# Altium schematic sheet EsquematicoVrBikeV1.SchDoc
size A
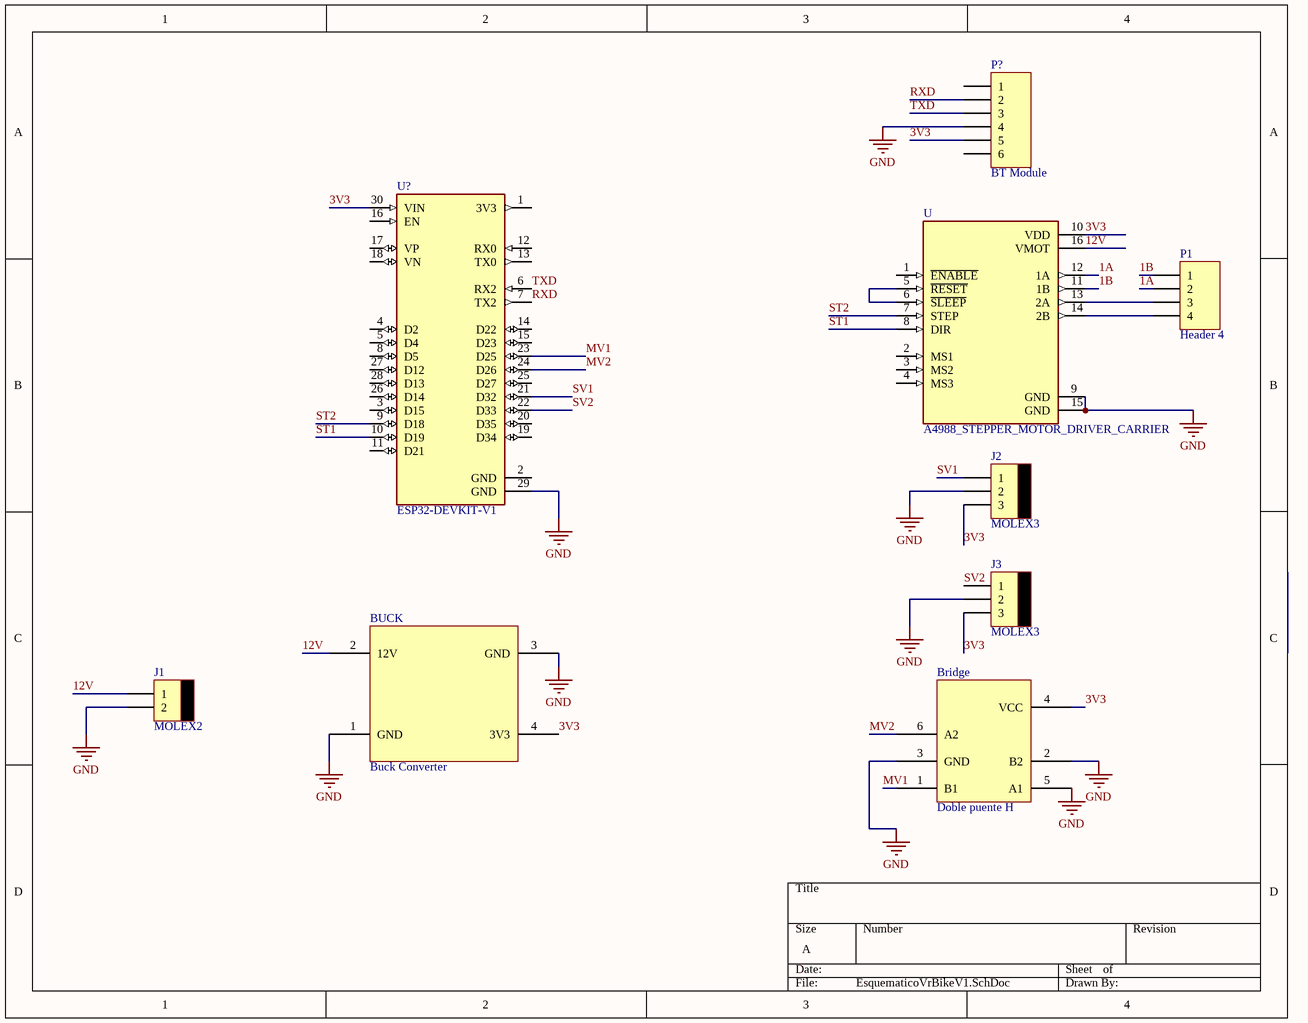
[diagram p0: EsquematicoVrBikeV1.SchDoc]

## Parts
Bridge  Doble puente H  [Vibration Driver]
BUCK  Buck Converter  [Buck Converter Modulo]
J1  MOLEX2  [MOLEX2]
J2  MOLEX3  [MOLEX3]
J3  MOLEX3  [MOLEX3]
P1  Header 4  [HDR1X4]
P?  BT Module  [HDR1X6]
U  A4988_STEPPER_MOTOR_DRIVER_CARRIER  [MODULE_A4988_STEPPER_MOTOR_DRIVER_CARRIER]
U?  ESP32-DEVKIT-V1  [MODULE_ESP32_DEVKIT_V1]

## Nets
GND: Bridge.2(B2) Bridge.3(GND) Bridge.5(A1) BUCK.1(GND) BUCK.3(GND) J1.2 J2.2 J3.2 P?.4 U.9(GND) U.15(GND) U?.29(GND)
1A: P1.2 U.12(1A)
1B: P1.1 U.11(1B)
3V3: Bridge.4(VCC) BUCK.4(3V3) J2.3 J3.3 P?.5 U.10(VDD) U?.30(VIN)
12V: BUCK.2(12V) J1.1 U.16(VMOT)
MV1: Bridge.1(B1) U?.23(D25)
MV2: Bridge.6(A2) U?.24(D26)
RXD: P?.2 U?.7(TX2)
ST1: U.8(DIR) U?.10(D19)
ST2: U.7(STEP) U?.9(D18)
SV1: J2.1 U?.21(D32)
SV2: J3.1 U?.22(D33)
TXD: P?.3 U?.6(RX2)
NetP1_3: P1.3 U.13(2A)
NetP1_4: P1.4 U.14(2B)
NetU_5: U.5(~{RESET}) U.6(~{SLEEP})

Not connected (* = marked no-connect by the designer): P? 1 6; U 1(~{ENABLE}) 2(MS1) 3(MS2) 4(MS3); U? 1(3V3) 2(GND) 3(D15) 4(D2) 5(D4) 8(D5) 11(D21) 12(RX0) 13(TX0) 14(D22) 15(D23) 16(EN) 17(VP) 18(VN) 19(D34) 20(D35) 25(D27) 26(D14) 27(D12) 28(D13)

## Library data of the parts
Bridge = Component_1: Modulo Doble puente H motores vibración
BUCK = Component_1: Buck Converter module
P1 = Header 4: Header, 4-Pin; LatestRevisionDate: 17-Jul-2002; LatestRevisionNote: Re-released for DXP Platform.; Publisher: Altium Limited
P? = Header 6: Header, 6-Pin; LatestRevisionDate: 17-Jul-2002; LatestRevisionNote: Re-released for DXP Platform.; Publisher: Altium Limited
U = A4988_STEPPER_MOTOR_DRIVER_CARRIER: Stepper Motor Driver; MP: A4988 STEPPER MOTOR DRIVER CARRIER; MF: Pololu; Availability: Unavailable; Price: None; Package: None; Value: *; SnapEDA_Link: https://www.snapeda.com/parts/A4988%20STEPPER%20MOTOR%20DRIVER%20CARRIER/Pololu/view-part/1499394/?ref=snap
U? = ESP32-DEVKIT-V1: Dual core, Wi-Fi: 2.4 GHz up to 150 Mbits/s,BLE (Bluetooth Low Energy) and legacy Bluetooth, 32 bits, Up to 240 MHz; MF: Do it; Value: *; MP: ESP32-DEVKIT-V1; SnapEDA_Link: https://www.snapeda.com/parts/ESP32-DEVKIT-V1/Do+it/view-part/?ref=snap; Price: None; Package: None; Check_prices: https://www.snapeda.com/parts/ESP32-DEVKIT-V1/Do+it/view-part/?ref=eda; Availability: Not in stock